# Altium project PCB_Project.PrjPcb (part 1 of 4)
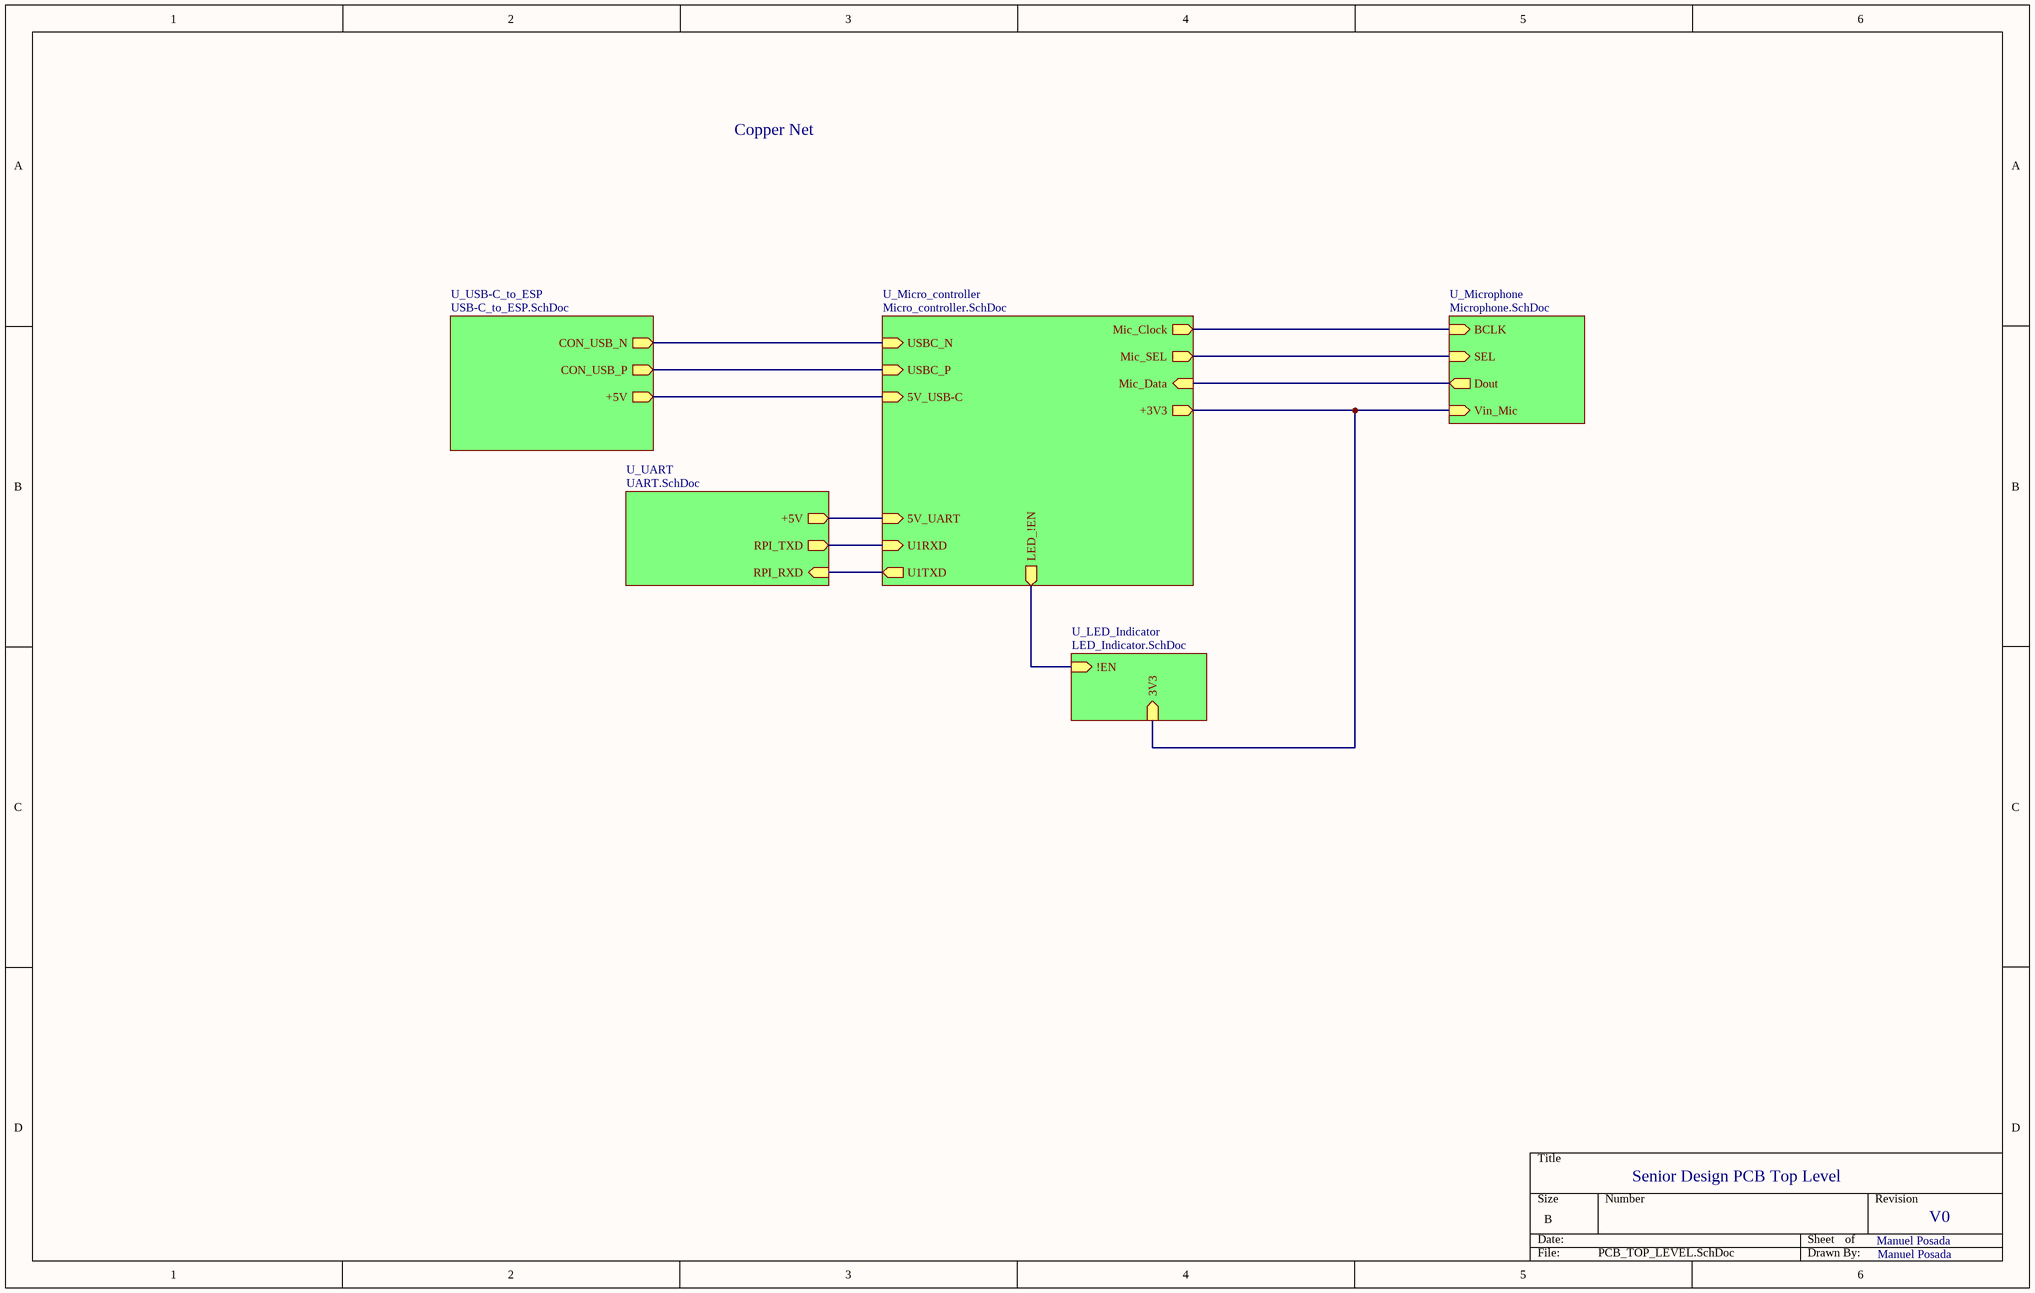
[diagram p0: PCB_TOP_LEVEL.SchDoc]
6 sheets, 64 parts. Net scope: hierarchical (ports join the sheet entries above them; power ports are global).
Board file: PCB1.PcbDoc
Sheets:
  PCB_TOP_LEVEL.SchDoc
    U_Micro_controller = Micro_controller.SchDoc
    U_USB-C_to_ESP = USB-C_to_ESP.SchDoc
    U_Microphone = Microphone.SchDoc
    U_UART = UART.SchDoc
    U_LED_Indicator = LED_Indicator.SchDoc

## Sheet PCB_TOP_LEVEL.SchDoc
size B; SheetNumber: 1; SheetTotal: 6

### Sub-sheets
U_LED_Indicator = LED_Indicator.SchDoc: 3V3 (in), !EN (in)
U_Micro_controller = Micro_controller.SchDoc: Mic_Data (in), Mic_SEL (out), Mic_Clock (out), U1TXD (out), U1RXD (in), LED_!EN (out), USBC_N (in), USBC_P (in), 5V_USB-C (in), 5V_UART (in), +3V3 (out)
U_Microphone = Microphone.SchDoc: Vin_Mic (in), BCLK (in), Dout (out), SEL (in)
U_UART = UART.SchDoc: RPI_RXD (in), RPI_TXD (out), +5V (out)
U_USB-C_to_ESP = USB-C_to_ESP.SchDoc: +5V (out), CON_USB_N (out), CON_USB_P (out)

### Nets
3.3V: sheet U_Micro_controller/+3V3, sheet U_Microphone/Vin_Mic, sheet U_LED_Indicator/3V3
GPIO6: sheet U_Micro_controller/Mic_SEL, sheet U_Microphone/SEL
GPIO7: sheet U_Micro_controller/Mic_Data, sheet U_Microphone/Dout
GPIO8: sheet U_Micro_controller/Mic_Clock, sheet U_Microphone/BCLK
GPIO17: sheet U_Micro_controller/U1TXD, sheet U_UART/RPI_RXD
GPIO18: sheet U_Micro_controller/U1RXD, sheet U_UART/RPI_TXD
GPIO19: sheet U_Micro_controller/USBC_N, sheet U_USB-C_to_ESP/CON_USB_N
GPIO20: sheet U_Micro_controller/USBC_P, sheet U_USB-C_to_ESP/CON_USB_P
GPIO38: sheet U_Micro_controller/LED_!EN, sheet U_LED_Indicator/!EN
NetR1_1: sheet U_Micro_controller/5V_USB-C, sheet U_USB-C_to_ESP/+5V
NetR4_1: sheet U_Micro_controller/5V_UART, sheet U_UART/+5V

### Notes on the sheet
- Copper Net
- Senior Design PCB Top Level
- Manuel Posada
- V0

## Sheet Micro_controller.SchDoc
size C; SheetNumber: 3; SheetTotal: 6
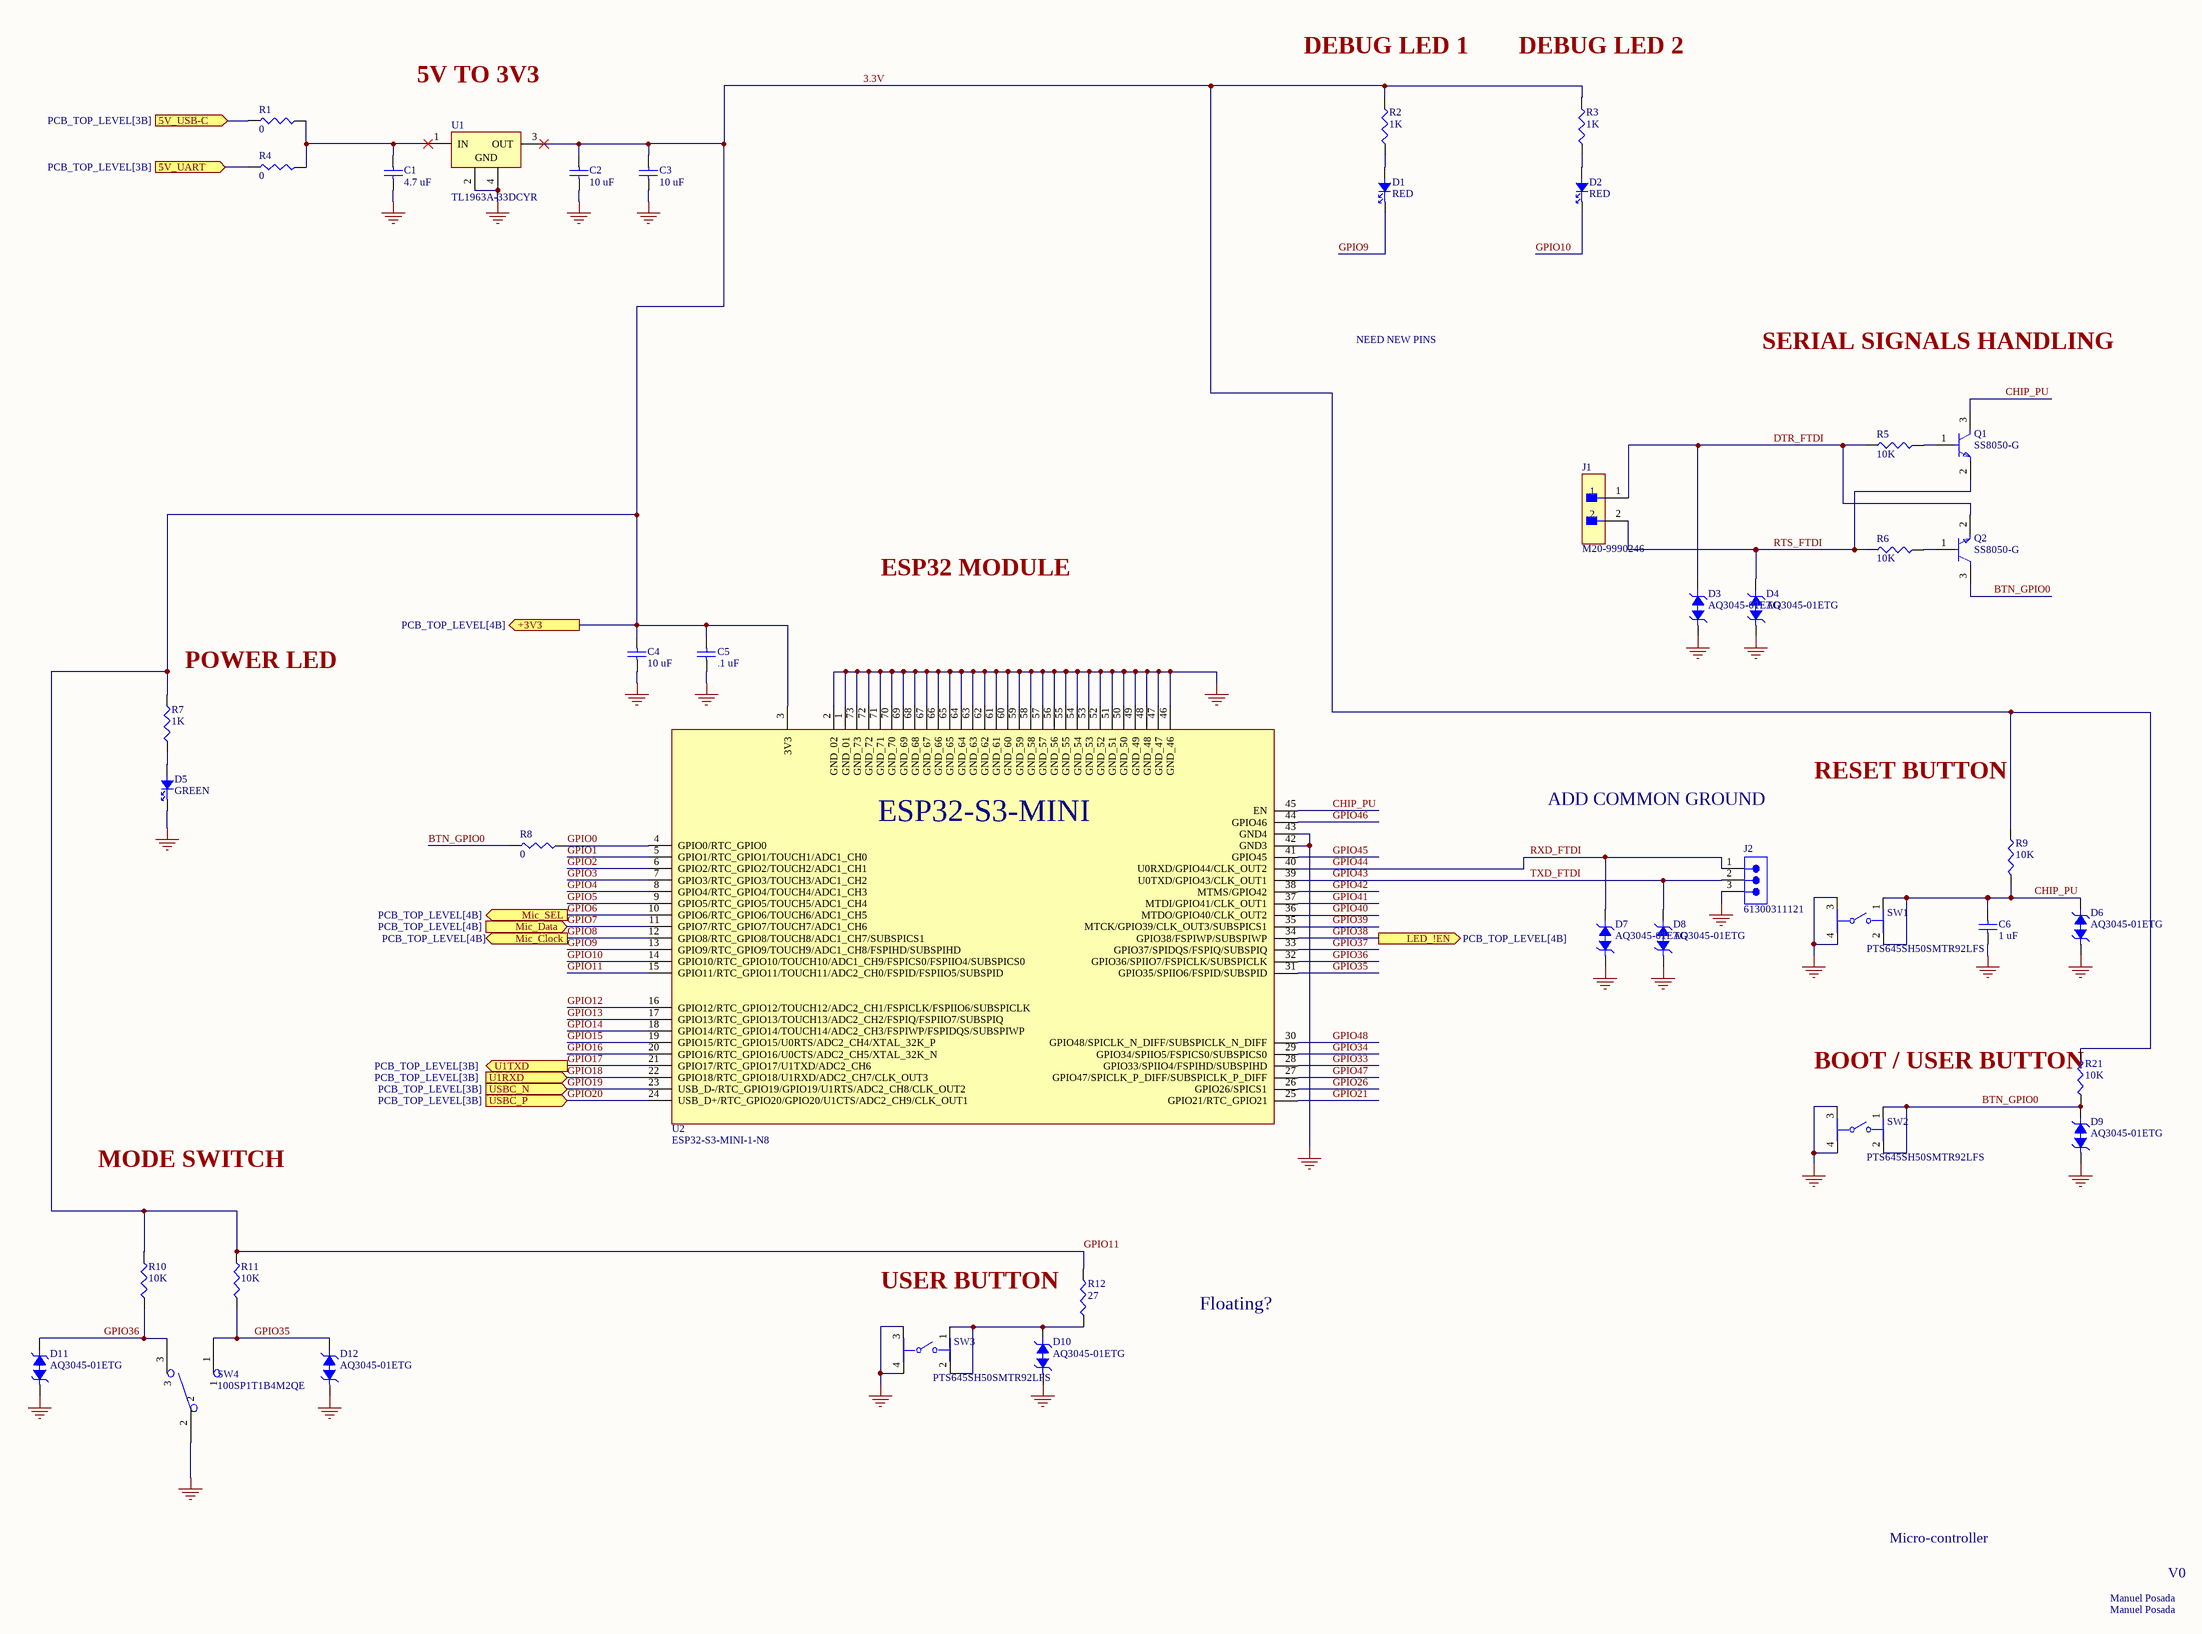
[diagram p1: Micro_controller.SchDoc]

### Parts
C1  4.7 uF  [CAP_CL21_SAM-L]
C2  10 uF  [CAP_CL21_SAM-L]
C3  10 uF  [CAP_CL21_SAM-L]
C4  10 uF  [CAP_CL21_SAM-L]
C5  .1 uF  [CAP_CL21_SAM-L]
C6  1 uF  [CAP_CL21_SAM-L]
D1  RED  [LED0402R]
D2  RED  [LED0402R]
D3  AQ3045-01ETG  [SOD882]
D4  AQ3045-01ETG  [SOD882]
D5  GREEN  [LED0402G]
D6  AQ3045-01ETG  [SOD882]
D7  AQ3045-01ETG  [SOD882]
D8  AQ3045-01ETG  [SOD882]
D9  AQ3045-01ETG  [SOD882]
D10  AQ3045-01ETG  [SOD882]
D11  AQ3045-01ETG  [SOD882]
D12  AQ3045-01ETG  [SOD882]
J1  M20-9990246  [CONN2_M20-999_1x2_HRW]
J2  61300311121  [61300311121]
Q1  SS8050-G  [FP-SS8050-G-IPC_B]
Q2  SS8050-G  [FP-SS8050-G-IPC_B]
R1  0  [RES_1220_SUS-L]
R2  1K  [RES_1220_SUS-L]
R3  1K  [RES_1220_SUS-L]
R4  0  [RES_1220_SUS-L]
R5  10K  [RES_1220_SUS-L]
R6  10K  [RES_1220_SUS-L]
R7  1K  [RES_1220_SUS-L]
R8  0  [RES_1220_SUS-L]
R9  10K  [RES_1220_SUS-L]
R10  10K  [RES_1220_SUS-L]
R11  10K  [RES_1220_SUS-L]
R12  27  [RES_1220_SUS-L]
R21  10K  [RES_1220_SUS-L]
SW1  PTS645SH50SMTR92LFS  [FP-PTS645SH50SMTR92LFS-MFG]
SW2  PTS645SH50SMTR92LFS  [FP-PTS645SH50SMTR92LFS-MFG]
SW3  PTS645SH50SMTR92LFS  [FP-PTS645SH50SMTR92LFS-MFG]
SW4  100SP1T1B4M2QE  [100SP1T1_EWI]
U1  TL1963A-33DCYR  [DCY0004A_N]
U2  ESP32-S3-MINI-1-N8  [XCVR_ESP32-S3-MINI-1-N8]

### Ports
5V_UART (in, see PCB_TOP_LEVEL[3B]), 5V_USB-C (in, see PCB_TOP_LEVEL[3B]), +3V3 (out, see PCB_TOP_LEVEL[4B]), LED_!EN (out, see PCB_TOP_LEVEL[4B]), Mic_Clock (out, see PCB_TOP_LEVEL[4B]), Mic_Data (in, see PCB_TOP_LEVEL[4B]), Mic_SEL (out, see PCB_TOP_LEVEL[4B]), U1RXD (in, see PCB_TOP_LEVEL[3B]), U1TXD (out, see PCB_TOP_LEVEL[3B]), USBC_N (in, see PCB_TOP_LEVEL[3B]), USBC_P (in, see PCB_TOP_LEVEL[3B])

### Nets
GND: C1.1 C2.1 C3.1 C4.1 C5.1 C6.1 D3.1 D4.1 D5.1 D6.1 D7.1 D8.1 D9.1 D10.1 D11.1 D12.1 J2.3 SW1.3 SW1.4 SW2.3 SW2.4 SW3.3 SW3.4 SW4.2 U1.2(GND) U1.4(GND) U2.1(GND_01) U2.2(GND_02) U2.42(GND3) U2.43(GND4) U2.46(GND_46) U2.47(GND_47) U2.48(GND_48) U2.49(GND_49) U2.50(GND_50) U2.51(GND_51) U2.52(GND_52) U2.53(GND_53) U2.54(GND_54) U2.55(GND_55) U2.56(GND_56) U2.57(GND_57) U2.58(GND_58) U2.59(GND_59) U2.60(GND_60) U2.61(GND_61) U2.62(GND_62) U2.63(GND_63) U2.64(GND_64) U2.65(GND_65) U2.66(GND_66) U2.67(GND_67) U2.68(GND_68) U2.69(GND_69) U2.70(GND_70) U2.71(GND_71) U2.72(GND_72) U2.73(GND_73)
3.3V: C2.2 C3.2 C4.2 C5.2 R2.2 R3.2 R7.2 R9.2 R10.2 R11.2 R12.2 R21.2 U1.3(OUT) U2.3(3V3) U2.15(GPIO11/RTC_GPIO11/TOUCH11/ADC2_CH0/FSPID/FSPIIO5/SUBSPID) ; port +3V3  [also labelled GPIO11]
BTN_GPIO0: D9.2 Q2.3(C) R8.1 R21.1 SW2.1 SW2.2
CHIP_PU: C6.2 D6.2 Q1.3(C) R9.1 SW1.1 SW1.2 U2.45(EN)
DTR_FTDI: D3.2 J1.1 Q2.2(E) R5.1
GPIO0: R8.2 U2.4(GPIO0/RTC_GPIO0)
GPIO1: U2.5(GPIO1/RTC_GPIO1/TOUCH1/ADC1_CH0)
GPIO2: U2.6(GPIO2/RTC_GPIO2/TOUCH2/ADC1_CH1)
GPIO3: U2.7(GPIO3/RTC_GPIO3/TOUCH3/ADC1_CH2)
GPIO4: U2.8(GPIO4/RTC_GPIO4/TOUCH4/ADC1_CH3)
GPIO5: U2.9(GPIO5/RTC_GPIO5/TOUCH5/ADC1_CH4)
GPIO6: U2.10(GPIO6/RTC_GPIO6/TOUCH6/ADC1_CH5) ; port Mic_SEL
GPIO7: U2.11(GPIO7/RTC_GPIO7/TOUCH7/ADC1_CH6) ; port Mic_Data
GPIO8: U2.12(GPIO8/RTC_GPIO8/TOUCH8/ADC1_CH7/SUBSPICS1) ; port Mic_Clock
GPIO9: D1.1 U2.13(GPIO9/RTC_GPIO9/TOUCH9/ADC1_CH8/FSPIHD/SUBSPIHD)
GPIO10: D2.1 U2.14(GPIO10/RTC_GPIO10/TOUCH10/ADC1_CH9/FSPICS0/FSPIIO4/SUBSPICS0)
GPIO12: U2.16(GPIO12/RTC_GPIO12/TOUCH12/ADC2_CH1/FSPICLK/FSPIIO6/SUBSPICLK)
GPIO13: U2.17(GPIO13/RTC_GPIO13/TOUCH13/ADC2_CH2/FSPIQ/FSPIIO7/SUBSPIQ)
GPIO14: U2.18(GPIO14/RTC_GPIO14/TOUCH14/ADC2_CH3/FSPIWP/FSPIDQS/SUBSPIWP)
GPIO15: U2.19(GPIO15/RTC_GPIO15/U0RTS/ADC2_CH4/XTAL_32K_P)
GPIO16: U2.20(GPIO16/RTC_GPIO16/U0CTS/ADC2_CH5/XTAL_32K_N)
GPIO17: U2.21(GPIO17/RTC_GPIO17/U1TXD/ADC2_CH6) ; port U1TXD
GPIO18: U2.22(GPIO18/RTC_GPIO18/U1RXD/ADC2_CH7/CLK_OUT3) ; port U1RXD
GPIO19: U2.23(USB_D-/RTC_GPIO19/GPIO19/U1RTS/ADC2_CH8/CLK_OUT2) ; port USBC_N
GPIO20: U2.24(USB_D+/RTC_GPIO20/GPIO20/U1CTS/ADC2_CH9/CLK_OUT1) ; port USBC_P
GPIO21: U2.25(GPIO21/RTC_GPIO21)
GPIO26: U2.26(GPIO26/SPICS1)
GPIO33: U2.28(GPIO33/SPIIO4/FSPIHD/SUBSPIHD)
GPIO34: U2.29(GPIO34/SPIIO5/FSPICS0/SUBSPICS0)
GPIO35: D12.2 R11.1 SW4.1 U2.31(GPIO35/SPIIO6/FSPID/SUBSPID)
GPIO36: D11.2 R10.1 SW4.3 U2.32(GPIO36/SPIIO7/FSPICLK/SUBSPICLK)
GPIO37: U2.33(GPIO37/SPIDQS/FSPIQ/SUBSPIQ)
GPIO38: U2.34(GPIO38/FSPIWP/SUBSPIWP) ; port LED_!EN
GPIO39: U2.35(MTCK/GPIO39/CLK_OUT3/SUBSPICS1)
GPIO40: U2.36(MTDO/GPIO40/CLK_OUT2)
GPIO41: U2.37(MTDI/GPIO41/CLK_OUT1)
GPIO42: U2.38(MTMS/GPIO42)
GPIO43: D8.2 J2.2 U2.39(U0TXD/GPIO43/CLK_OUT1)  [also labelled TXD_FTDI]
GPIO44: D7.2 J2.1 U2.40(U0RXD/GPIO44/CLK_OUT2)  [also labelled RXD_FTDI]
GPIO45: U2.41(GPIO45)
GPIO46: U2.44(GPIO46)
GPIO47: U2.27(GPIO47/SPICLK_P_DIFF/SUBSPICLK_P_DIFF)
GPIO48: U2.30(GPIO48/SPICLK_N_DIFF/SUBSPICLK_N_DIFF)
RTS_FTDI: D4.2 J1.2 Q1.2(E) R6.1
NetC1_2: C1.2 R1.2 R4.2 U1.1(IN)
NetD1_2: D1.2 R2.1
NetD2_2: D2.2 R3.1
NetD5_2: D5.2 R7.1
NetD10_2: D10.2 R12.1 SW3.1 SW3.2
NetQ1_1: Q1.1(B) R5.2
NetQ2_1: Q2.1(B) R6.2
NetR1_1: R1.1 ; port 5V_USB-C
NetR4_1: R4.1 ; port 5V_UART

### Notes on the sheet
- DEBUG LED 1
- DEBUG LED 2
- 5V TO 3V3
- SERIAL SIGNALS HANDLING
- NEED NEW PINS
- ESP32 MODULE
- (near R7) POWER LED
- RESET BUTTON
- ADD COMMON GROUND
- BOOT / USER BUTTON
- MODE SWITCH
- USER BUTTON
- Floating?
- Micro-controller
- Manuel Posada
- V0
- (in symbol ESP32-S3-MINI-1-N8) ESP32-S3-MINI